# Altium project MOSFETS.PrjPcb
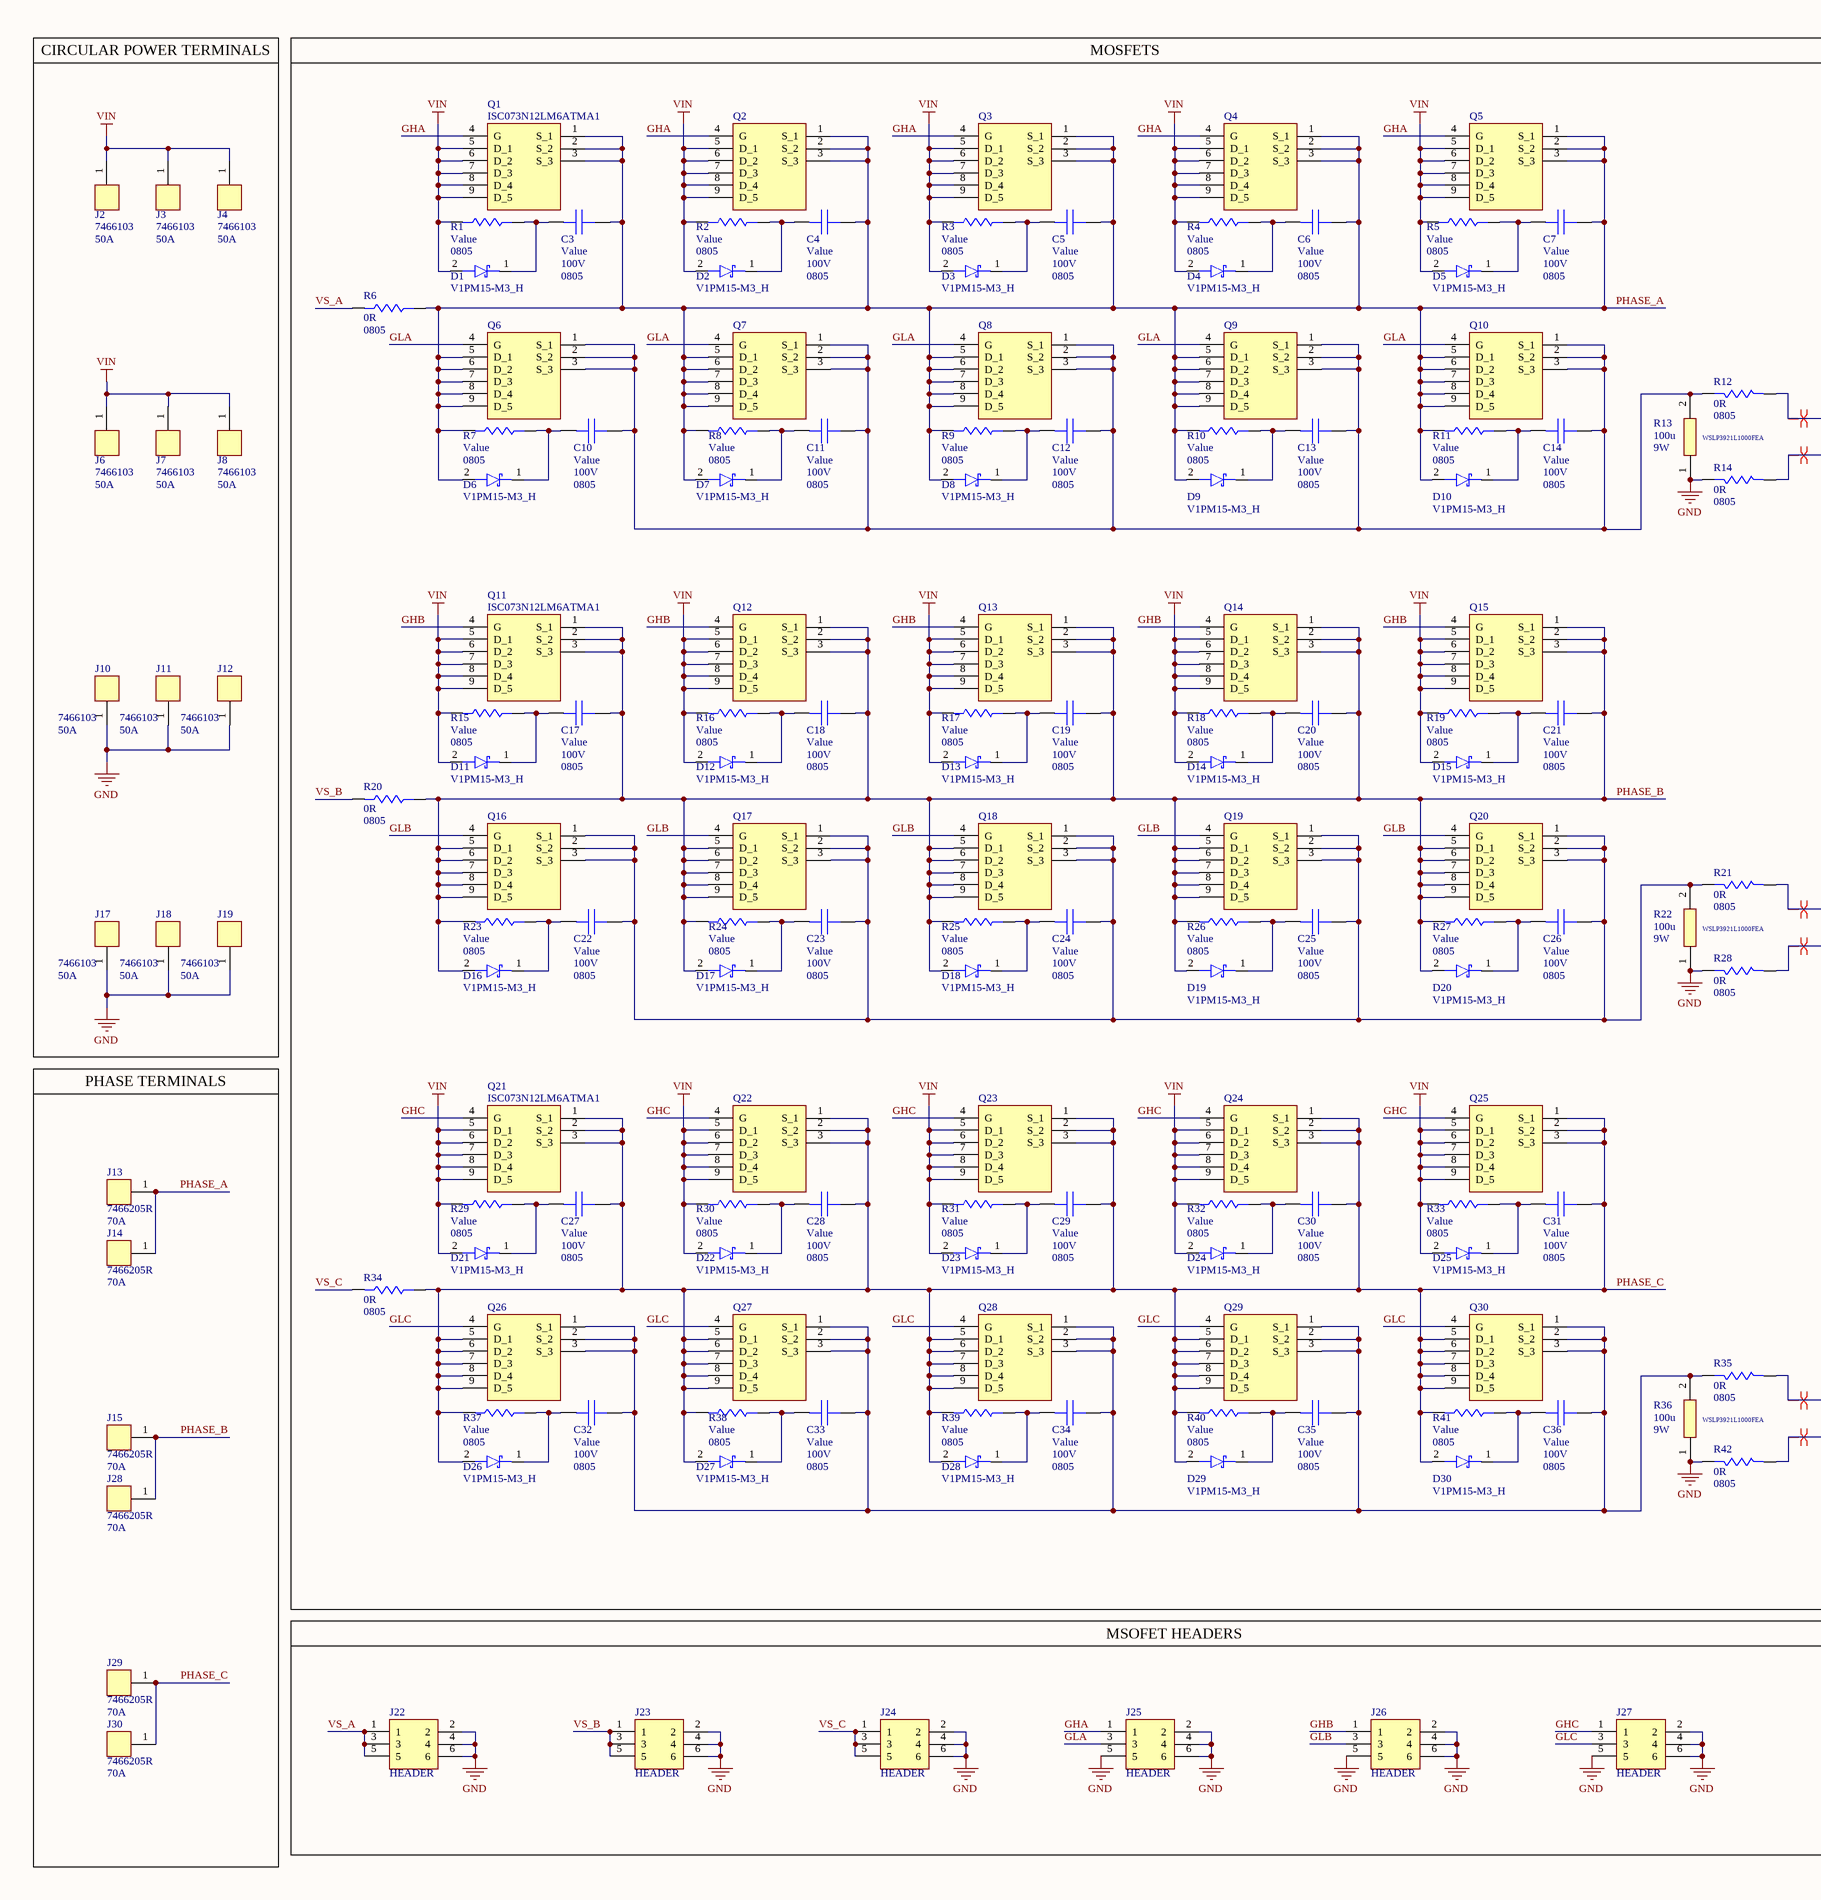
[diagram p0: Mosfets.SchDoc, left]
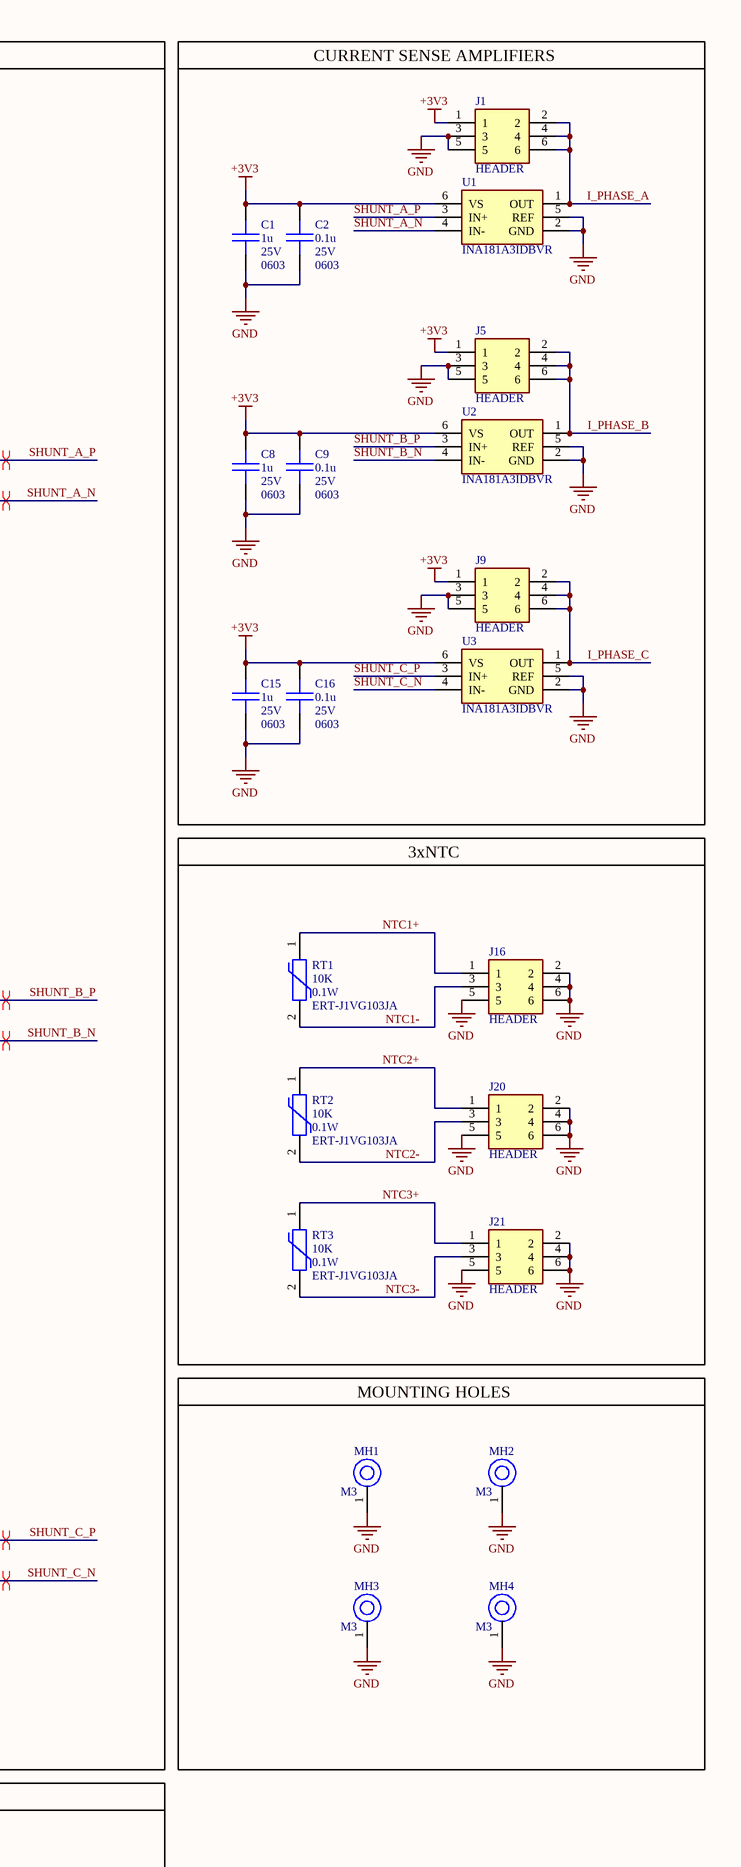
[diagram p1: Mosfets.SchDoc, right]
1 sheet, 178 parts. Net scope: global (net labels, ports and power ports of the same name join across sheets).
Board file: MOSFET.PcbDoc

## Sheet Mosfets.SchDoc
size A2; SheetNumber: 1; SheetTotal: 1

### Parts
C1  0603  value 1u  Voltage: 25V  [C_0603]
C2  0603  value 0.1u  Voltage: 25V  [C_0603]
C3  0805  Voltage: 100V  [C_0805]
C4  0805  Voltage: 100V  [C_0805]
C5  0805  Voltage: 100V  [C_0805]
C6  0805  Voltage: 100V  [C_0805]
C7  0805  Voltage: 100V  [C_0805]
C8  0603  value 1u  Voltage: 25V  [C_0603]
C9  0603  value 0.1u  Voltage: 25V  [C_0603]
C10  0805  Voltage: 100V  [C_0805]
C11  0805  Voltage: 100V  [C_0805]
C12  0805  Voltage: 100V  [C_0805]
C13  0805  Voltage: 100V  [C_0805]
C14  0805  Voltage: 100V  [C_0805]
C15  0603  value 1u  Voltage: 25V  [C_0603]
C16  0603  value 0.1u  Voltage: 25V  [C_0603]
C17  0805  Voltage: 100V  [C_0805]
C18  0805  Voltage: 100V  [C_0805]
C19  0805  Voltage: 100V  [C_0805]
C20  0805  Voltage: 100V  [C_0805]
C21  0805  Voltage: 100V  [C_0805]
C22  0805  Voltage: 100V  [C_0805]
C23  0805  Voltage: 100V  [C_0805]
C24  0805  Voltage: 100V  [C_0805]
C25  0805  Voltage: 100V  [C_0805]
C26  0805  Voltage: 100V  [C_0805]
C27  0805  Voltage: 100V  [C_0805]
C28  0805  Voltage: 100V  [C_0805]
C29  0805  Voltage: 100V  [C_0805]
C30  0805  Voltage: 100V  [C_0805]
C31  0805  Voltage: 100V  [C_0805]
C32  0805  Voltage: 100V  [C_0805]
C33  0805  Voltage: 100V  [C_0805]
C34  0805  Voltage: 100V  [C_0805]
C35  0805  Voltage: 100V  [C_0805]
C36  0805  Voltage: 100V  [C_0805]
D1  V1PM15-M3_H  [DO-219AD-2]
D2  V1PM15-M3_H  [DO-219AD-2]
D3  V1PM15-M3_H  [DO-219AD-2]
D4  V1PM15-M3_H  [DO-219AD-2]
D5  V1PM15-M3_H  [DO-219AD-2]
D6  V1PM15-M3_H  [DO-219AD-2]
D7  V1PM15-M3_H  [DO-219AD-2]
D8  V1PM15-M3_H  [DO-219AD-2]
D9  V1PM15-M3_H  [DO-219AD-2]
D10  V1PM15-M3_H  [DO-219AD-2]
D11  V1PM15-M3_H  [DO-219AD-2]
D12  V1PM15-M3_H  [DO-219AD-2]
D13  V1PM15-M3_H  [DO-219AD-2]
D14  V1PM15-M3_H  [DO-219AD-2]
D15  V1PM15-M3_H  [DO-219AD-2]
D16  V1PM15-M3_H  [DO-219AD-2]
D17  V1PM15-M3_H  [DO-219AD-2]
D18  V1PM15-M3_H  [DO-219AD-2]
D19  V1PM15-M3_H  [DO-219AD-2]
D20  V1PM15-M3_H  [DO-219AD-2]
D21  V1PM15-M3_H  [DO-219AD-2]
D22  V1PM15-M3_H  [DO-219AD-2]
D23  V1PM15-M3_H  [DO-219AD-2]
D24  V1PM15-M3_H  [DO-219AD-2]
D25  V1PM15-M3_H  [DO-219AD-2]
D26  V1PM15-M3_H  [DO-219AD-2]
D27  V1PM15-M3_H  [DO-219AD-2]
D28  V1PM15-M3_H  [DO-219AD-2]
D29  V1PM15-M3_H  [DO-219AD-2]
D30  V1PM15-M3_H  [DO-219AD-2]
J1  HEADER  [HEADER_MALE_2X3_1.27MM]
J2  7466103  Current: 50A  [7466203]
J3  7466103  Current: 50A  [7466203]
J4  7466103  Current: 50A  [7466203]
J5  HEADER  [HEADER_MALE_2X3_1.27MM]
J6  7466103  Current: 50A  [7466203]
J7  7466103  Current: 50A  [7466203]
J8  7466103  Current: 50A  [7466203]
J9  HEADER  [HEADER_MALE_2X3_1.27MM]
J10  7466103  Current: 50A  [7466203]
J11  7466103  Current: 50A  [7466203]
J12  7466103  Current: 50A  [7466203]
J13  7466205R  Current: 70A  [7466205R]
J14  7466205R  Current: 70A  [7466205R]
J15  7466205R  Current: 70A  [7466205R]
J16  HEADER  [HEADER_MALE_2X3_1.27MM]
J17  7466103  Current: 50A  [7466203]
J18  7466103  Current: 50A  [7466203]
J19  7466103  Current: 50A  [7466203]
J20  HEADER  [HEADER_MALE_2X3_1.27MM]
J21  HEADER  [HEADER_MALE_2X3_1.27MM]
J22  HEADER  [HEADER_MALE_2X3_1.27MM]
J23  HEADER  [HEADER_MALE_2X3_1.27MM]
J24  HEADER  [HEADER_MALE_2X3_1.27MM]
J25  HEADER  [HEADER_MALE_2X3_1.27MM]
J26  HEADER  [HEADER_MALE_2X3_1.27MM]
J27  HEADER  [HEADER_MALE_2X3_1.27MM]
J28  7466205R  Current: 70A  [7466205R]
J29  7466205R  Current: 70A  [7466205R]
J30  7466205R  Current: 70A  [7466205R]
MH1  M3  [MOUNTING_HOLE_M3]
MH2  M3  [MOUNTING_HOLE_M3]
MH3  M3  [MOUNTING_HOLE_M3]
MH4  M3  [MOUNTING_HOLE_M3]
Q1  ISC073N12LM6ATMA1  [TDSON-8]
Q2  ISC073N12LM6ATMA1  [TDSON-8]  (value not drawn)
Q3  ISC073N12LM6ATMA1  [TDSON-8]  (value not drawn)
Q4  ISC073N12LM6ATMA1  [TDSON-8]  (value not drawn)
Q5  ISC073N12LM6ATMA1  [TDSON-8]  (value not drawn)
Q6  ISC073N12LM6ATMA1  [TDSON-8]  (value not drawn)
Q7  ISC073N12LM6ATMA1  [TDSON-8]  (value not drawn)
Q8  ISC073N12LM6ATMA1  [TDSON-8]  (value not drawn)
Q9  ISC073N12LM6ATMA1  [TDSON-8]  (value not drawn)
Q10  ISC073N12LM6ATMA1  [TDSON-8]  (value not drawn)
Q11  ISC073N12LM6ATMA1  [TDSON-8]
Q12  ISC073N12LM6ATMA1  [TDSON-8]  (value not drawn)
Q13  ISC073N12LM6ATMA1  [TDSON-8]  (value not drawn)
Q14  ISC073N12LM6ATMA1  [TDSON-8]  (value not drawn)
Q15  ISC073N12LM6ATMA1  [TDSON-8]  (value not drawn)
Q16  ISC073N12LM6ATMA1  [TDSON-8]  (value not drawn)
Q17  ISC073N12LM6ATMA1  [TDSON-8]  (value not drawn)
Q18  ISC073N12LM6ATMA1  [TDSON-8]  (value not drawn)
Q19  ISC073N12LM6ATMA1  [TDSON-8]  (value not drawn)
Q20  ISC073N12LM6ATMA1  [TDSON-8]  (value not drawn)
Q21  ISC073N12LM6ATMA1  [TDSON-8]
Q22  ISC073N12LM6ATMA1  [TDSON-8]  (value not drawn)
Q23  ISC073N12LM6ATMA1  [TDSON-8]  (value not drawn)
Q24  ISC073N12LM6ATMA1  [TDSON-8]  (value not drawn)
Q25  ISC073N12LM6ATMA1  [TDSON-8]  (value not drawn)
Q26  ISC073N12LM6ATMA1  [TDSON-8]  (value not drawn)
Q27  ISC073N12LM6ATMA1  [TDSON-8]  (value not drawn)
Q28  ISC073N12LM6ATMA1  [TDSON-8]  (value not drawn)
Q29  ISC073N12LM6ATMA1  [TDSON-8]  (value not drawn)
Q30  ISC073N12LM6ATMA1  [TDSON-8]  (value not drawn)
R1  0805  [R_0805]
R2  0805  [R_0805]
R3  0805  [R_0805]
R4  0805  [R_0805]
R5  0805  [R_0805]
R6  0805  value 0R  [R_0805]
R7  0805  [R_0805]
R8  0805  [R_0805]
R9  0805  [R_0805]
R10  0805  [R_0805]
R11  0805  [R_0805]
R12  0805  value 0R  [R_0805]
R13  WSLP3921L1000FEA  value 100u  Watt: 9W  [R_3921]
R14  0805  value 0R  [R_0805]
R15  0805  [R_0805]
R16  0805  [R_0805]
R17  0805  [R_0805]
R18  0805  [R_0805]
R19  0805  [R_0805]
R20  0805  value 0R  [R_0805]
R21  0805  value 0R  [R_0805]
R22  WSLP3921L1000FEA  value 100u  Watt: 9W  [R_3921]
R23  0805  [R_0805]
R24  0805  [R_0805]
R25  0805  [R_0805]
R26  0805  [R_0805]
R27  0805  [R_0805]
R28  0805  value 0R  [R_0805]
R29  0805  [R_0805]
R30  0805  [R_0805]
R31  0805  [R_0805]
R32  0805  [R_0805]
R33  0805  [R_0805]
R34  0805  value 0R  [R_0805]
R35  0805  value 0R  [R_0805]
R36  WSLP3921L1000FEA  value 100u  Watt: 9W  [R_3921]
R37  0805  [R_0805]
R38  0805  [R_0805]
R39  0805  [R_0805]
R40  0805  [R_0805]
R41  0805  [R_0805]
R42  0805  value 0R  [R_0805]
RT1  ERT-J1VG103JA  value 10K  Watt: 0.1W  [R_0603]
RT2  ERT-J1VG103JA  value 10K  Watt: 0.1W  [R_0603]
RT3  ERT-J1VG103JA  value 10K  Watt: 0.1W  [R_0603]
U1  INA181A3IDBVR  [SOT23-6]
U2  INA181A3IDBVR  [SOT23-6]
U3  INA181A3IDBVR  [SOT23-6]

### Blocks framed on the sheet
CIRCULAR POWER TERMINALS: J2-J4 J6-J8 J10-J12 J17-J19
MOSFETS: C3-C7 C10-C14 C17-C36 D1-D30 Q1-Q30 R1-R42
CURRENT SENSE AMPLIFIERS: C1 C2 C8 C9 C15 C16 J1 J5 J9 U1-U3
3xNTC: J16 J20 J21 RT1-RT3
PHASE TERMINALS: J13-J15 J28-J30
MOUNTING HOLES: MH1-MH4
MSOFET HEADERS: J22-J27

### Nets
+3V3: C1.1 C2.1 C8.1 C9.1 C15.1 C16.1 J1.1 J5.1 J9.1 U1.6(VS) U2.6(VS) U3.6(VS)
GND: C1.2 C2.2 C8.2 C9.2 C15.2 C16.2 J1.3 J1.5 J5.3 J5.5 J9.3 J9.5 J10.1 J11.1 J12.1 J16.2 J16.4 J16.5 J16.6 J17.1 J18.1 J19.1 J20.2 J20.4 J20.5 J20.6 J21.2 J21.4 J21.5 J21.6 J22.2 J22.4 J22.6 J23.2 J23.4 J23.6 J24.2 J24.4 J24.6 J25.2 J25.4 J25.5 J25.6 J26.2 J26.4 J26.5 J26.6 J27.2 J27.4 J27.5 J27.6 MH1.1 MH2.1 MH3.1 MH4.1 R13.1 R14.2 R22.1 R28.2 R36.1 R42.2 U1.2(GND) U1.5(REF) U2.2(GND) U2.5(REF) U3.2(GND) U3.5(REF)
VIN: D1.2(A) D2.2(A) D3.2(A) D4.2(A) D5.2(A) D11.2(A) D12.2(A) D13.2(A) D14.2(A) D15.2(A) D21.2(A) D22.2(A) D23.2(A) D24.2(A) D25.2(A) J2.1 J3.1 J4.1 J6.1 J7.1 J8.1 Q1.5(D_1) Q1.6(D_2) Q1.7(D_3) Q1.8(D_4) Q1.9(D_5) Q2.5(D_1) Q2.6(D_2) Q2.7(D_3) Q2.8(D_4) Q2.9(D_5) Q3.5(D_1) Q3.6(D_2) Q3.7(D_3) Q3.8(D_4) Q3.9(D_5) Q4.5(D_1) Q4.6(D_2) Q4.7(D_3) Q4.8(D_4) Q4.9(D_5) Q5.5(D_1) Q5.6(D_2) Q5.7(D_3) Q5.8(D_4) Q5.9(D_5) Q11.5(D_1) Q11.6(D_2) Q11.7(D_3) Q11.8(D_4) Q11.9(D_5) Q12.5(D_1) Q12.6(D_2) Q12.7(D_3) Q12.8(D_4) Q12.9(D_5) Q13.5(D_1) Q13.6(D_2) Q13.7(D_3) Q13.8(D_4) Q13.9(D_5) Q14.5(D_1) Q14.6(D_2) Q14.7(D_3) Q14.8(D_4) Q14.9(D_5) Q15.5(D_1) Q15.6(D_2) Q15.7(D_3) Q15.8(D_4) Q15.9(D_5) Q21.5(D_1) Q21.6(D_2) Q21.7(D_3) Q21.8(D_4) Q21.9(D_5) Q22.5(D_1) Q22.6(D_2) Q22.7(D_3) Q22.8(D_4) Q22.9(D_5) Q23.5(D_1) Q23.6(D_2) Q23.7(D_3) Q23.8(D_4) Q23.9(D_5) Q24.5(D_1) Q24.6(D_2) Q24.7(D_3) Q24.8(D_4) Q24.9(D_5) Q25.5(D_1) Q25.6(D_2) Q25.7(D_3) Q25.8(D_4) Q25.9(D_5) R1.1 R2.1 R3.1 R4.1 R5.1 R15.1 R16.1 R17.1 R18.1 R19.1 R29.1 R30.1 R31.1 R32.1 R33.1
GHA: J25.1 Q1.4(G) Q2.4(G) Q3.4(G) Q4.4(G) Q5.4(G)
GHB: J26.1 Q11.4(G) Q12.4(G) Q13.4(G) Q14.4(G) Q15.4(G)
GHC: J27.1 Q21.4(G) Q22.4(G) Q23.4(G) Q24.4(G) Q25.4(G)
GLA: J25.3 Q6.4(G) Q7.4(G) Q8.4(G) Q9.4(G) Q10.4(G)
GLB: J26.3 Q16.4(G) Q17.4(G) Q18.4(G) Q19.4(G) Q20.4(G)
GLC: J27.3 Q26.4(G) Q27.4(G) Q28.4(G) Q29.4(G) Q30.4(G)
I_PHASE_A: J1.2 J1.4 J1.6 U1.1(OUT)
I_PHASE_B: J5.2 J5.4 J5.6 U2.1(OUT)
I_PHASE_C: J9.2 J9.4 J9.6 U3.1(OUT)
NTC1+: J16.1 RT1.1
NTC1-: J16.3 RT1.2
NTC2+: J20.1 RT2.1
NTC2-: J20.3 RT2.2
NTC3+: J21.1 RT3.1
NTC3-: J21.3 RT3.2
PHASE_A: C3.2 C4.2 C5.2 C6.2 C7.2 D6.2(A) D7.2(A) D8.2(A) D9.2(A) D10.2(A) J13.1 J14.1 Q1.1(S_1) Q1.2(S_2) Q1.3(S_3) Q2.1(S_1) Q2.2(S_2) Q2.3(S_3) Q3.1(S_1) Q3.2(S_2) Q3.3(S_3) Q4.1(S_1) Q4.2(S_2) Q4.3(S_3) Q5.1(S_1) Q5.2(S_2) Q5.3(S_3) Q6.5(D_1) Q6.6(D_2) Q6.7(D_3) Q6.8(D_4) Q6.9(D_5) Q7.5(D_1) Q7.6(D_2) Q7.7(D_3) Q7.8(D_4) Q7.9(D_5) Q8.5(D_1) Q8.6(D_2) Q8.7(D_3) Q8.8(D_4) Q8.9(D_5) Q9.5(D_1) Q9.6(D_2) Q9.7(D_3) Q9.8(D_4) Q9.9(D_5) Q10.5(D_1) Q10.6(D_2) Q10.7(D_3) Q10.8(D_4) Q10.9(D_5) R6.2 R7.1 R8.1 R9.1 R10.1 R11.1
PHASE_B: C17.2 C18.2 C19.2 C20.2 C21.2 D16.2(A) D17.2(A) D18.2(A) D19.2(A) D20.2(A) J15.1 J28.1 Q11.1(S_1) Q11.2(S_2) Q11.3(S_3) Q12.1(S_1) Q12.2(S_2) Q12.3(S_3) Q13.1(S_1) Q13.2(S_2) Q13.3(S_3) Q14.1(S_1) Q14.2(S_2) Q14.3(S_3) Q15.1(S_1) Q15.2(S_2) Q15.3(S_3) Q16.5(D_1) Q16.6(D_2) Q16.7(D_3) Q16.8(D_4) Q16.9(D_5) Q17.5(D_1) Q17.6(D_2) Q17.7(D_3) Q17.8(D_4) Q17.9(D_5) Q18.5(D_1) Q18.6(D_2) Q18.7(D_3) Q18.8(D_4) Q18.9(D_5) Q19.5(D_1) Q19.6(D_2) Q19.7(D_3) Q19.8(D_4) Q19.9(D_5) Q20.5(D_1) Q20.6(D_2) Q20.7(D_3) Q20.8(D_4) Q20.9(D_5) R20.2 R23.1 R24.1 R25.1 R26.1 R27.1
PHASE_C: C27.2 C28.2 C29.2 C30.2 C31.2 D26.2(A) D27.2(A) D28.2(A) D29.2(A) D30.2(A) J29.1 J30.1 Q21.1(S_1) Q21.2(S_2) Q21.3(S_3) Q22.1(S_1) Q22.2(S_2) Q22.3(S_3) Q23.1(S_1) Q23.2(S_2) Q23.3(S_3) Q24.1(S_1) Q24.2(S_2) Q24.3(S_3) Q25.1(S_1) Q25.2(S_2) Q25.3(S_3) Q26.5(D_1) Q26.6(D_2) Q26.7(D_3) Q26.8(D_4) Q26.9(D_5) Q27.5(D_1) Q27.6(D_2) Q27.7(D_3) Q27.8(D_4) Q27.9(D_5) Q28.5(D_1) Q28.6(D_2) Q28.7(D_3) Q28.8(D_4) Q28.9(D_5) Q29.5(D_1) Q29.6(D_2) Q29.7(D_3) Q29.8(D_4) Q29.9(D_5) Q30.5(D_1) Q30.6(D_2) Q30.7(D_3) Q30.8(D_4) Q30.9(D_5) R34.2 R37.1 R38.1 R39.1 R40.1 R41.1
SHUNT_A_N: R14.1 U1.4(IN-)
SHUNT_A_P: R12.1 U1.3(IN+)
SHUNT_B_N: R28.1 U2.4(IN-)
SHUNT_B_P: R21.1 U2.3(IN+)
SHUNT_C_N: R42.1 U3.4(IN-)
SHUNT_C_P: R35.1 U3.3(IN+)
VS_A: J22.1 J22.3 J22.5 R6.1
VS_B: J23.1 J23.3 J23.5 R20.1
VS_C: J24.1 J24.3 J24.5 R34.1
NetC3_1: C3.1 D1.1(K) R1.2
NetC4_1: C4.1 D2.1(K) R2.2
NetC5_1: C5.1 D3.1(K) R3.2
NetC6_1: C6.1 D4.1(K) R4.2
NetC7_1: C7.1 D5.1(K) R5.2
NetC10_1: C10.1 D6.1(K) R7.2
NetC10_2: C10.2 C11.2 C12.2 C13.2 C14.2 Q6.1(S_1) Q6.2(S_2) Q6.3(S_3) Q7.1(S_1) Q7.2(S_2) Q7.3(S_3) Q8.1(S_1) Q8.2(S_2) Q8.3(S_3) Q9.1(S_1) Q9.2(S_2) Q9.3(S_3) Q10.1(S_1) Q10.2(S_2) Q10.3(S_3) R12.2 R13.2
NetC11_1: C11.1 D7.1(K) R8.2
NetC12_1: C12.1 D8.1(K) R9.2
NetC13_1: C13.1 D9.1(K) R10.2
NetC14_1: C14.1 D10.1(K) R11.2
NetC17_1: C17.1 D11.1(K) R15.2
NetC18_1: C18.1 D12.1(K) R16.2
NetC19_1: C19.1 D13.1(K) R17.2
NetC20_1: C20.1 D14.1(K) R18.2
NetC21_1: C21.1 D15.1(K) R19.2
NetC22_1: C22.1 D16.1(K) R23.2
NetC22_2: C22.2 C23.2 C24.2 C25.2 C26.2 Q16.1(S_1) Q16.2(S_2) Q16.3(S_3) Q17.1(S_1) Q17.2(S_2) Q17.3(S_3) Q18.1(S_1) Q18.2(S_2) Q18.3(S_3) Q19.1(S_1) Q19.2(S_2) Q19.3(S_3) Q20.1(S_1) Q20.2(S_2) Q20.3(S_3) R21.2 R22.2
NetC23_1: C23.1 D17.1(K) R24.2
NetC24_1: C24.1 D18.1(K) R25.2
NetC25_1: C25.1 D19.1(K) R26.2
NetC26_1: C26.1 D20.1(K) R27.2
NetC27_1: C27.1 D21.1(K) R29.2
NetC28_1: C28.1 D22.1(K) R30.2
NetC29_1: C29.1 D23.1(K) R31.2
NetC30_1: C30.1 D24.1(K) R32.2
NetC31_1: C31.1 D25.1(K) R33.2
NetC32_1: C32.1 D26.1(K) R37.2
NetC32_2: C32.2 C33.2 C34.2 C35.2 C36.2 Q26.1(S_1) Q26.2(S_2) Q26.3(S_3) Q27.1(S_1) Q27.2(S_2) Q27.3(S_3) Q28.1(S_1) Q28.2(S_2) Q28.3(S_3) Q29.1(S_1) Q29.2(S_2) Q29.3(S_3) Q30.1(S_1) Q30.2(S_2) Q30.3(S_3) R35.2 R36.2
NetC33_1: C33.1 D27.1(K) R38.2
NetC34_1: C34.1 D28.1(K) R39.2
NetC35_1: C35.1 D29.1(K) R40.2
NetC36_1: C36.1 D30.1(K) R41.2

### Layout directives
differential pair: SHUNT_A_N, SHUNT_A_P, SHUNT_B_N, SHUNT_B_P, SHUNT_C_N, SHUNT_C_P

### Library data of the parts
C1 C2 C8 C9 C15 C16 = CAP_0603: SMD Chip Capacitor - 0603; ComponentLink1Description: Link; ComponentLink1URL: *
C3-C7 C10-C14 C17-C36 = CAP_0805: SMD Chip Capacitor - 0805; ComponentLink1Description: Link; ComponentLink1URL: *; Value: Value
D1-D30 = DIODE_SCHOTTKY_V1PM15-M3_H: Schottky Diode, 150V, 1A, Vf: 1.13V; Vf: 1.3V; ComponentLink1Description: New link; ComponentLink1URL: https://www.mouser.com.tr/ProductDetail/Vishay-General-Semiconductor/V1PM15-M3-H?qs=%252BdQmOuGyFcHNPmRG94B76g%3D%3D; Vrm: 150V; If: 1A
J1 J5 J9 J16 J20-J27 = HEADER_SMD_2X3_1.27MM
J2-J4 J6-J8 J10-J12 J17-J19 = TERMINAL_7466203: Terminals, SMT, M3 Thread, 50A; ComponentLink1Description: New link; ComponentLink1URL: https://www.mouser.com.tr/ProductDetail/Wurth-Elektronik/7466203?qs=IfoubJuuTRb774UUJ30heA%3D%3D
J13-J15 J28-J30 = TERMINAL_7466205R: Terminals, SMT, M5 Thread, 70A; ComponentLink1Description: New link; ComponentLink1URL: https://www.mouser.com.tr/ProductDetail/Wurth-Elektronik/7466205R?qs=lBTPRtX1sU8D2oI%252B7M8jdw%3D%3D
MH1-MH4 = Mounting_Hole_M3: M3 Mounting Hole
Q1-Q30 = MOSFET_N_ISC073N12LM6ATMA1: N Channel MOSFET, 120V, 86A, 7.3mR; Qgate: 14.4nC; ComponentLink1Description: New link; ComponentLink1URL: https://www.mouser.com.tr/ProductDetail/Infineon-Technologies/ISC073N12LM6ATMA1?qs=amGC7iS6iy8CGAbD5A4F5Q%3D%3D; Vds: 120V; Ids: 86A; Rds(on): 7.3mR
R1-R12 R14-R21 R23-R35 R37-R42 = RES_0805: SMD Chip Resistor - 0805; ComponentLink1Description: Link; ComponentLink1URL: *; Tolerance: ?; Watt: *
  R1-R5 R7-R11 R15-R19 R23-R27 R29-R33 R37-R41: Value: Value
R13 R22 R36 = RES_SHUNT_100uR_9W: Shunt Resistor, 100uR, 9W; Tolerance: %1; ComponentLink1Description: New link; ComponentLink1URL: https://www.mouser.com.tr/ProductDetail/Vishay-Dale/WSLP3921L1000FEA?qs=TiOZkKH1s2S5b3T%252BuIp%2FVQ%3D%3D
RT1-RT3 = NTC_0603: NTC Thermistors 0603 Package; Tolerance: %5; ComponentLink1Description: New link; ComponentLink1URL: https://www.mouser.com.tr/ProductDetail/Panasonic/ERT-J1VG103JA?qs=sGAEpiMZZMt1hubY80%2Fs8H%252BVnVr2XwzTQ3Tjm%2FhCYDQ%3D
U1-U3 = IC_INA181A3IDBVR: Current Sense Amplifiers, Vos: 100uV, Gain: 100V/V; ComponentLink1Description: New link; ComponentLink1URL: https://www.mouser.com.tr/ProductDetail/Texas-Instruments/INA181A3IDBVR?qs=5aG0NVq1C4xG8aOdRB7o5A%3D%3D